# EAGLE design Simon Game Rev G (EAGLE 9.6.2)
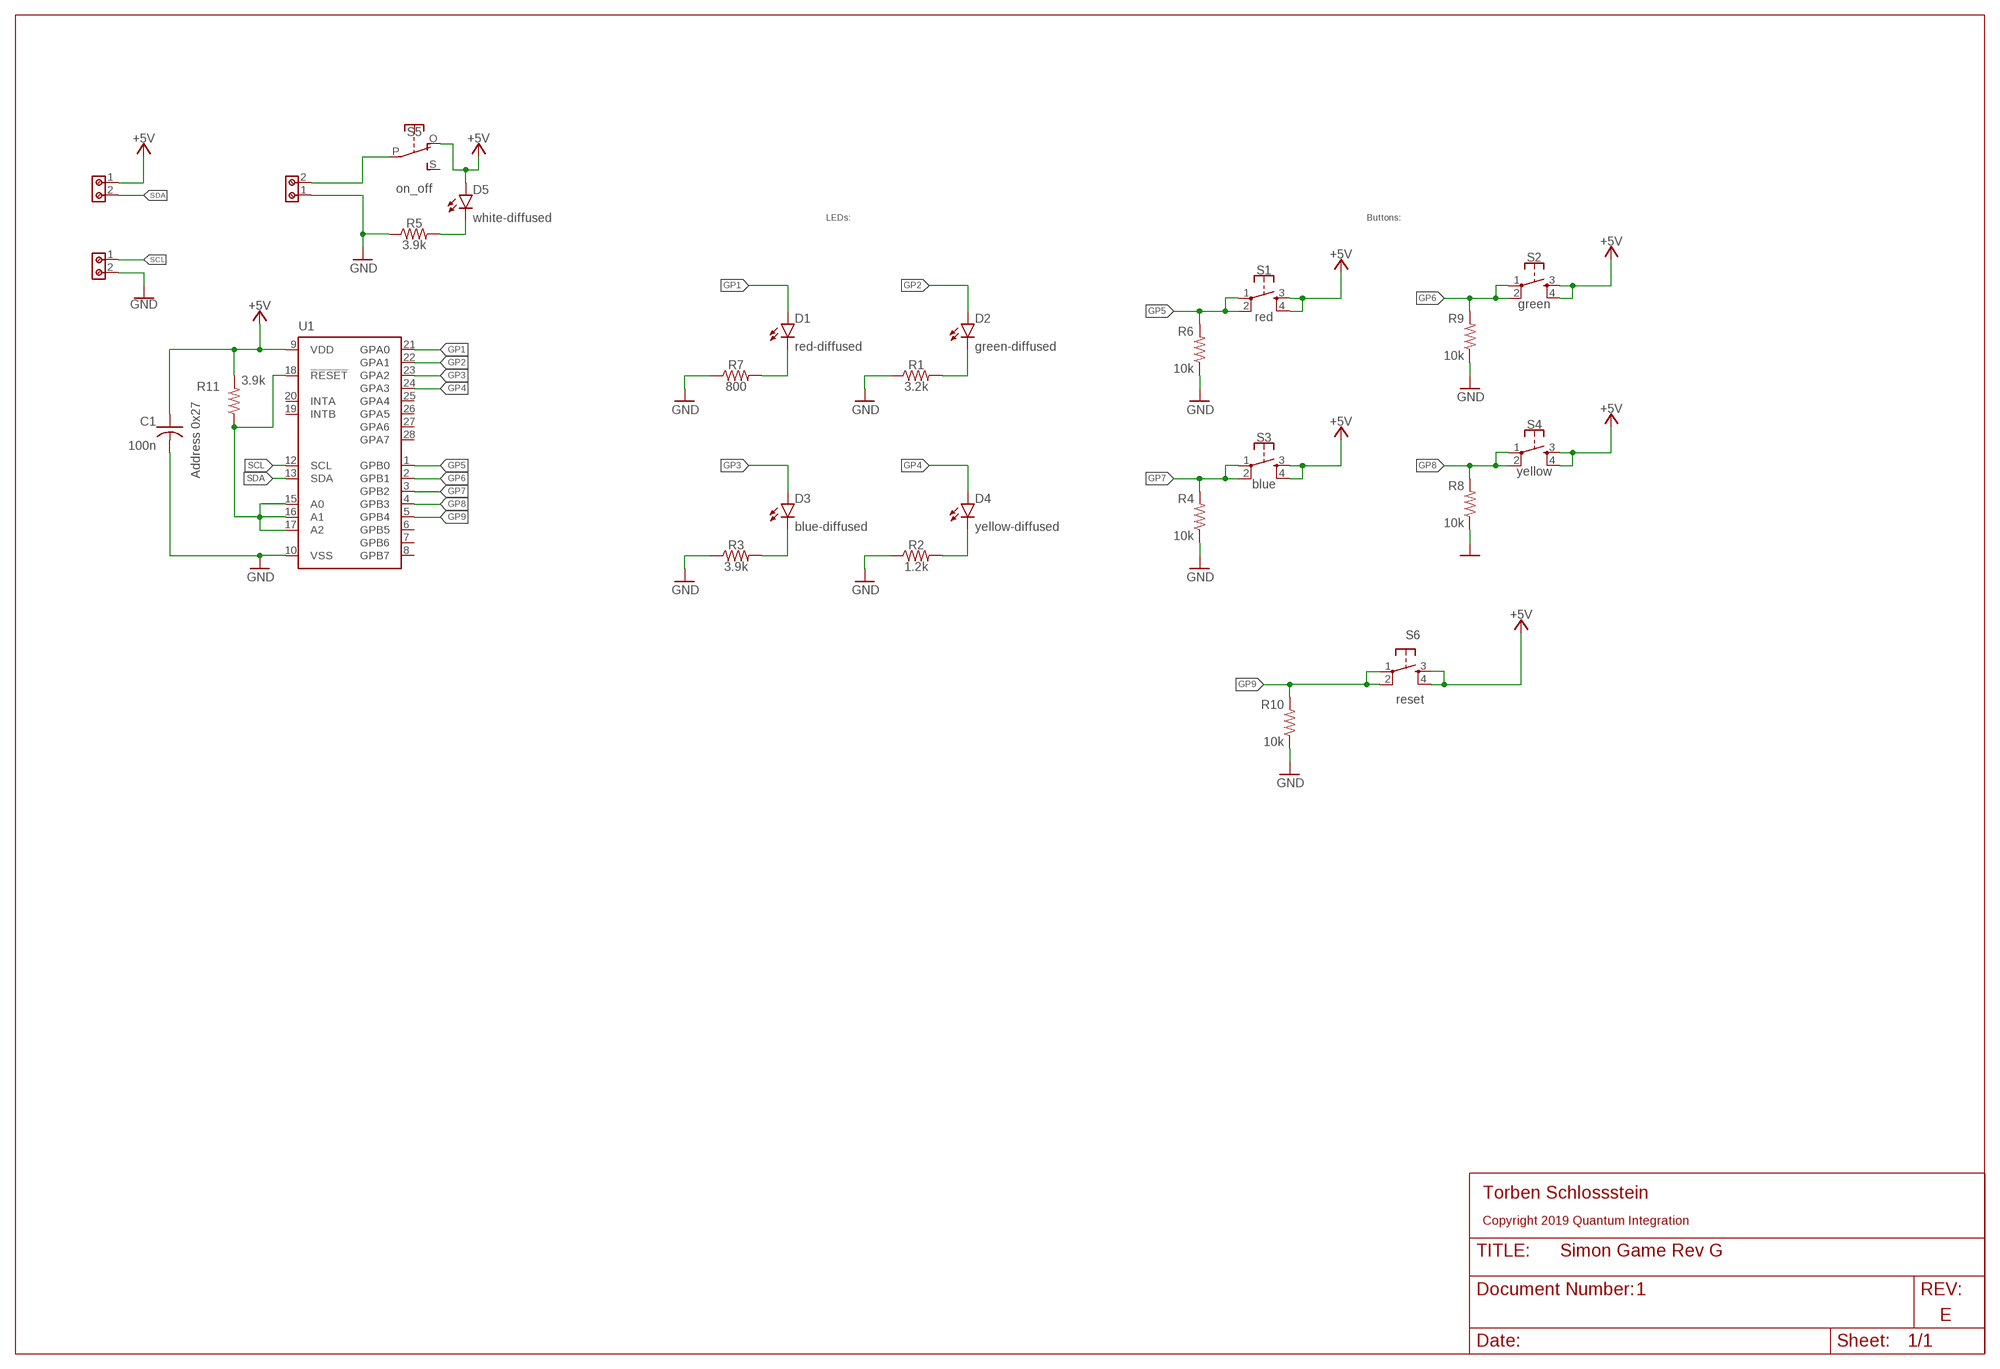
[diagram p0: schematic, sheet 1]

## Parts
C1  100n  THT-CER-CAPACITOR  [C050-024X044]
D1  red-diffused  LED  [LED5MM]
D2  green-diffused  LED  [LED5MM]
D3  blue-diffused  LED  [LED5MM]
D4  yellow-diffused  LED  [LED5MM]
D5  white-diffused  LED  [LED5MM]
J1  691214110002  [691214110002]
J2  691214110002  [691214110002]
J3  691214110002  [691214110002]
R1  3.2k  RESISTOR  [0207/10]
R2  1.2k  RESISTOR  [0207/10]
R3  3.9k  RESISTOR  [0207/10]
R4  10k  RESISTOR  [0207/10]
R5  3.9k  RESISTOR  [0207/10]
R6  10k  RESISTOR  [0207/10]
R7  800  RESISTOR  [0207/10]
R8  10k  RESISTOR  [0207/10]
R9  10k  RESISTOR  [0207/10]
R10  10k  RESISTOR  [0207/10]
R11  3.9k  RESISTOR  [0207/10]
S1  red  TACTILE-BUTTON40XX  [B3F-40XX]
S2  green  TACTILE-BUTTON40XX  [B3F-40XX]
S3  blue  TACTILE-BUTTON40XX  [B3F-40XX]
S4  yellow  TACTILE-BUTTON40XX  [B3F-40XX]
S5  on_off  SLIDE-SWITCHSIDE  [EG1270-90]
S6  reset  TACTILE-BUTTON10XX  [B3F-10XX]
U1  MCP23017  [DIL28-3]

## Nets
+5V: C1.1 D5.A J2.1 R11.2 S1.3(S) S1.4(S1) S2.3(S) S2.4(S1) S3.3(S) S3.4(S1) S4.3(S) S4.4(S1) S5.O S6.3(S) S6.4(S1) U1.9(VDD)
GND: C1.2 J1.1 J3.2 R1.1 R2.1 R3.1 R4.1 R5.1 R6.1 R7.1 R8.1 R9.1 R10.1 U1.10(VSS)
GP1: D1.A U1.21(GPA0)
GP2: D2.A U1.22(GPA1)
GP3: D3.A U1.23(GPA2)
GP4: D4.A U1.24(GPA3)
GP5: R6.2 S1.1(P) S1.2(P1) U1.1(GPB0)
GP6: R9.2 S2.1(P) S2.2(P1) U1.2(GPB1)
GP7: R4.2 S3.1(P) S3.2(P1) U1.3(GPB2)
GP8: R8.2 S4.1(P) S4.2(P1) U1.4(GPB3)
GP9: R10.2 S6.1(P) S6.2(P1) U1.5(GPB4)
N$1: D1.K(C) R7.2
N$2: D2.K(C) R1.2
N$3: D3.K(C) R3.2
N$4: D4.K(C) R2.2
N$5: R11.1 U1.15(A0) U1.16(A1) U1.17(A2) U1.18(!RESET)
N$9: J1.2 S5.P
N$16: D5.K(C) R5.2
SCL: J3.1 U1.12(SCL)
SDA: J2.2 U1.13(SDA)
Unconnected: S5.S U1.6(GPB5) U1.7(GPB6) U1.8(GPB7) U1.19(INTB) U1.20(INTA) U1.25(GPA4) U1.26(GPA5) U1.27(GPA6) U1.28(GPA7)

## Notes on the sheet
- LEDs: | Buttons:
- blue | yellow
- Address 0x27
- Torben Schlossstein
- Copyright 2019 Quantum Integration
- 1
- E

## Library data of the parts
C1 = Quantum Projects:THT-CER-CAPACITOR
D1-D5 = Quantum Projects:LED
J1-J3 = Wurth_Connectors_WR-TBL Rising Cage Clamp:691214110002: WR-TBL Serie 2141 - 3.50 mm Horiz. Entry Modular KIND PROPERTIES Pitch 3.5 mm MATERIAL PROPERTIES Insulator Material PA66 Insulator Flammability Rating UL94 V-0 Insulator Color Green Contact Material Brass Contact Plating Copper over Zinc Terminal Screw Material Steel Terminal Screw Plating Zinc Wire Guard Material Brass GENERAL INFORMATION Operating Temperature -40 up to +105 °C Compliance Lead free / RoHS ELECTRICAL PROPERTIES IR cULus 10 A Working Voltage [cULus] 300 V (AC) Withstanding Voltage [cULus] 1600 V (AC) Contact Resistance [cULus] 20 mΩ MECHANICAL PROPERTIES Wire Strip Length 5 up to 6 (mm) Screw M2 Solid Wire Section (AWG) 24 to 16 (AWG) Solid Wire Section (Metric) 0.205 to 1.31 (mm²) Stranded Wire Section (AWG) 24 to 16 (AWG) Stranded Wire Section (Metric) 0.205 to 1.31 (mm²) CERTIFICATION cULus Approval E315414 PACKAGING PROPERTIES Packaging Box <https://katalog.we-online.com/media/images/v2/o32858v209%20Family_WR-TBL2_Series2141S.jpg> Details see: https://katalog.we-online.com/en/em/TBL_3_50_2141_HORIZONTAL_ENTRY_MODULAR_69121411000X Updated by Ella Wu 2019-11-12 2019(C) Wurth Elektronik; DATASHEET-URL: https://www.we-online.com/catalog/datasheet/691214110002.pdf; IR-UL: 10A; MOUNT: THT; PART-NUMBER: 691214110002; PINS: 2; PITCH: 3.5mm; TYPE: Horizontal; WIRE: 24 to 16 (AWG) 0.205 to 1.31 (mm²); WORKING-VOLTAGE-UL: 300V (AC)
R1-R11 = Quantum Projects:RESISTOR
S1-S4 S6 = Quantum Projects:TACTILE-BUTTON
S5 = Quantum Projects:SLIDE-SWITCH
U1 = Quantum Projects:MCP23017

## Net classes
0 default: width 0.25 mm

## Board
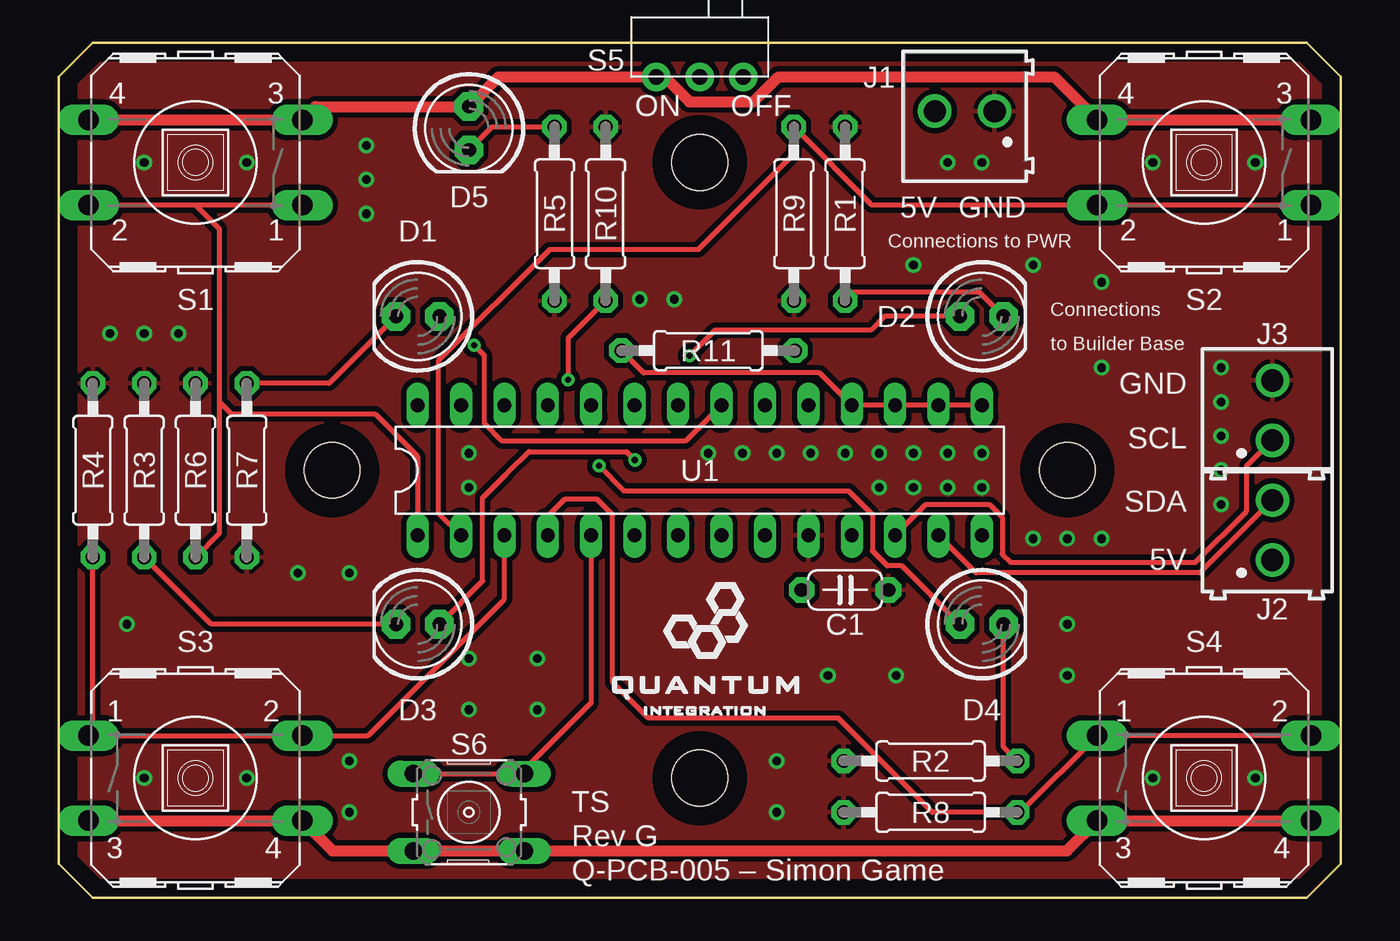
[diagram p1: board, top side]
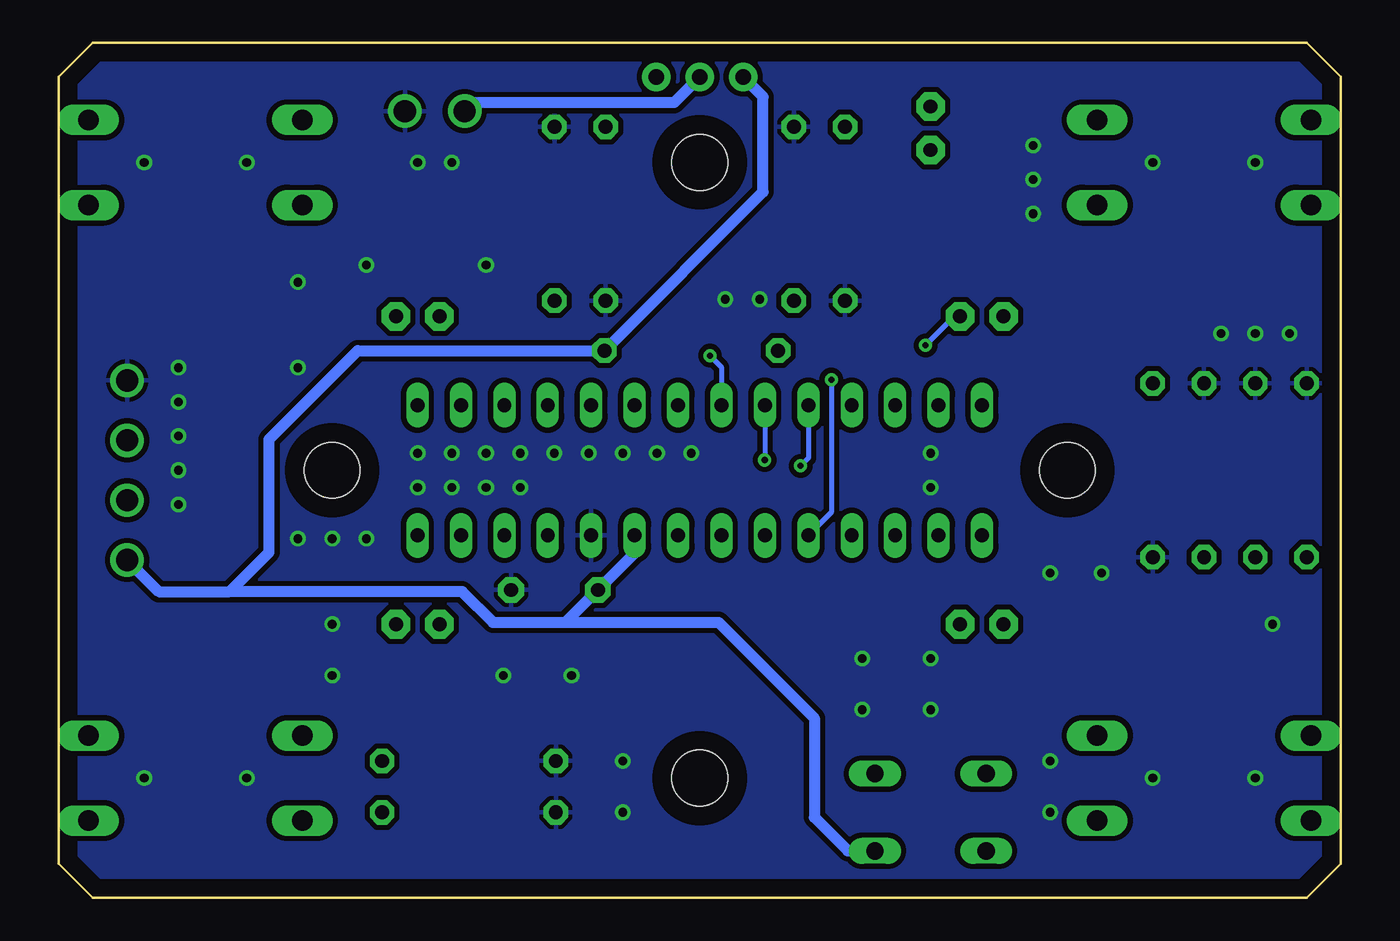
[diagram p2: board, bottom side, seen from below]

Size 75 x 50 mm. Coordinates in mm from the lower left corner, seen from the top.
Outline: 0,2 0,48 2,50 73,50 75,48 75,2 73,0 2,0 0,2
Copper layers (1*16): Top 0.035mm / dielectric 1.5mm / Bottom 0.035mm
Design rules "quantum_projects": minimum track width 12mil, minimum drill 14mil, track to track 12mil, track to pad 12mil, pad to pad 12mil, via to via 12mil, smd to smd 10mil, copper to edge 40mil, drill to drill 10mil, minimum pad ring 10mil, minimum via ring 8mil, stop-mask expansion 4mil, vias tented up to drill 40mil, thermal gap 10mil
Holes 3.25 mm at 16,25 59,25 37.5,43 37.5,7
tRestrict: area 13.2,22.2 to 18.8,27.8; area 56.2,22.2 to 61.8,27.8; area 34.8,40.2 to 40.2,45.8; area 34.8,4.2 to 40.2,9.8
bRestrict: area 13.2,22.2 to 18.8,27.8; area 56.2,22.2 to 61.8,27.8; area 34.8,40.2 to 40.2,45.8; area 34.8,4.2 to 40.2,9.8

### Footprints (pad centres in the part's own frame; a part is rotated, then mirrored left to right if it is on the bottom)
C050-024X044 = drill 0.813 pad 1.5 octagon: 1 -2.54,0; 2 2.54,0
LED5MM = drill 0.813 pad 1.676 octagon: A -1.27,0; K 1.27,0
691214110002 = drill 1.3: 1 -1.75,0; 2 1.75,0
0207/10 = drill 0.813 pad 1.43 octagon: 1 -5.08,0; 2 5.08,0
B3F-40XX = drill 1.194 long: 1 -6.248,2.489; 2 6.248,2.489; 3 -6.248,-2.489; 4 6.248,-2.489
EG1270-90 = drill 0.9 pad 1.676: O -2.54,0; P 0,0; S 2.54,0
B3F-10XX = drill 1.016 long: 1 -3.251,2.261; 2 3.251,2.261; 3 -3.251,-2.261; 4 3.251,-2.261
DIL28-3 = drill 0.813 long: 1 -16.51,-3.81; 2 -13.97,-3.81; 3 -11.43,-3.81; 4 -8.89,-3.81; 5 -6.35,-3.81; 6 -3.81,-3.81; 7 -1.27,-3.81; 8 1.27,-3.81; 9 3.81,-3.81; 10 6.35,-3.81; 11 8.89,-3.81; 12 11.43,-3.81; 13 13.97,-3.81; 14 16.51,-3.81; 15 16.51,3.81; 16 13.97,3.81; 17 11.43,3.81; 18 8.89,3.81; 19 6.35,3.81; 20 3.81,3.81; 21 1.27,3.81; 22 -1.27,3.81; 23 -3.81,3.81; 24 -6.35,3.81; 25 -8.89,3.81; 26 -11.43,3.81; 27 -13.97,3.81; 28 -16.51,3.81

### Placement (x,y rotation side)
C1  46,18 0 top
D1  21,34 180 top
D2  54,34 0 top
D3  21,16 180 top
D4  54,16 0 top
D5  24,45 270 top
J1  53,46 180 top
J2  71,21.5 90 top
J3  71,28.5 90 top
R1  46,40 270 top
R2  51,8 0 top
R3  5,25 270 top
R4  2,25 270 top
R5  29,40 90 top
R6  8,25 270 top
R7  11,25 90 top
R8  51,5 0 top
R9  43,40 90 top
R10  32,40 270 top
R11  38,32 0 top
S1  8,43 180 top
S2  67,43 180 top
S3  8,7 0 top
S4  67,7 0 top
S5  37.5,48 0 top
S6  24,5 0 top
U1  37.5,25 0 top

### Tracks (layer width: path | path; a pad name or v marks a point on that pad's centre or on a via)
+5V
  Top 0.635: S1.4 S1.3 15.03,46.27 D5.A 25.73,48 S5.O 35.44,48 36.9,46.54 40.65,46.54 42.1,48 58.24,48 S2.4 S2.3 | S4.4 S4.3 58.98,2.74 S6.4 S6.3 16.02,2.74 S3.4 S3.3
  Bottom 0.635: J2.1 69.15,17.9 65,17.9 | 45.36,16.1 49.6,16.1 51.4,17.9 65,17.9 | 45.36,16.1 C1.1 41.31,20.15 U1.9 | 45.36,16.1 36.4,16.1 30.8,10.5 30.8,4.7 28.84,2.74 S6.4 | 65,17.9 62.7,20.2 62.7,26.8 57.5,32 R11.2 33.8,41.28 33.8,46.84 S5.O
GND  (via drill 0.51)
  other vias: 54,24 54,26 52,26 52,24 50,24 50,26 48,26 48,24 46,26 44,26 42,26 40,26 38,26 24,26 24,24 5,43 11,43 5,7 11,7 64,7 70,7 70,43 64,43 24,11 28,11 28,14 24,14 3,33 5,33 7,33 18,44 18,42 18,40 52,43 54,43 36,35 34,35 17,19 14,19 4,16 45,13 49,13 42,8 42,5 59,16 59,13 57,21 59,21 61,21 68,31 68,29 68,27 68,25 68,23 61,31 61,36 57,37 50,37 17,5 17,8
  pour Bottom (rank 2): 0,48 2,50 73,50 75,48 75,2 73,0 2,0 0,2
  pour Top: 0,48 2,50 73,50 75,48 75,2 73,0 2,0 0,2
GP1  (via drill 0.36)
  Top 0.305: U1.21 36.66,26.7 25.94,26.7 24.9,27.74 24.9,31.7 v24.29,32.31
  Bottom 0.305: v24.29,32.31 22.6,34 D1.A
GP2  (via drill 0.36)
  Top 0.305: D2.A 48.3,34 47.5,33.2 38.4,33.2 v36.9,31.7
  Bottom 0.305: v36.9,31.7 36.23,31.03 U1.22
GP3  (via drill 0.36)
  Top 0.305: D3.A 24.8,18.53 24.8,23.4 26.2,24.8 26.3,24.9 27.49,26.09 33.21,26.09 v33.7,25.6
  Bottom 0.305: U1.23 v33.69,25.61 v33.7,25.6
GP4  (via drill 0.36)
  Top 0.305: D4.A 49.32,19.41 48.47,19.41 47.6,20.28 47.6,22.4 46.2,23.8 33.05,23.8 v31.6,25.25
  Bottom 0.305: U1.24 31.15,25.7 v31.6,25.25
GP5
  Top 0.305: S1.1 8,40.51 | 8,40.51 S1.2 | 8,40.51 9.4,39.11 9.4,29 | R6.2 9.4,21.32 9.4,29 | 9.4,29 10.1,28.3 18.5,28.3 20.99,25.81 U1.1
GP6
  Top 0.305: S2.1 S2.2 47.57,40.51 R9.2 43,43.5 37.4,37.9 28.7,37.9 22.2,31.4 22.2,22.52 U1.2
GP7
  Top 0.305: R4.2 2,9.74 S3.1 S3.2 18.09,9.49 26.07,17.47 U1.3
GP8
  Top 0.305: S4.2 S4.1 56.26,5 R8.2 51.1,5 45.6,10.5 34.5,10.5 32.4,12.6 32.4,22.4 31.5,23.3 29.6,23.3 28.6,22.3 U1.4
GP9  (via drill 0.36)
  Top 0.305: S6.1 27,7.26 | 27,7.26 S6.2 | U1.5 31.15,11.41 27,7.26 | R10.2 30.04,32.96 29.8,32.72 v29.8,30.3
  Bottom 0.305: v29.8,30.3 29.8,22.54 U1.5
N$1
  Top 0.305: D1.K 15.81,30.08 R7.2
N$2
  Top 0.305: D2.K 53.87,35.4 46.48,35.4 R1.2
N$3
  Top 0.305: D3.K 8.92,16 R3.2
N$4
  Top 0.305: R2.2 55.27,8.81 D4.K
N$5
  Top 0.305: U1.15 U1.16 U1.17 U1.18 44.5,30.7 34.22,30.7 R11.1
N$9
  Bottom 0.635: S5.P 39,46.5 50.75,46.5 J1.2
N$16
  Top 0.305: D5.K 25.35,45.08 R5.2
SCL
  Top 0.305: U1.12 50.74,23 54.44,23 55.2,22.24 55.2,20.1 55.69,19.61 66.5,19.61 69.5,22.61 69.5,25.25 J3.1
SDA
  Top 0.305: J2.2 66.75,19 53.66,19 U1.13

### Text on the board
tNames: ON | OFF | 5V | GND | Connections to PWR | Connections | to Builder Base | GND | SCL | SDA | 5V | TS | Rev G | Q-PCB-005 – Simon Game